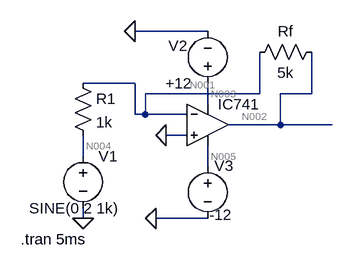
[diagram p0: schematic inverting closeloop.asc]
inverting closeloop.asc, the LTspice schematic file:
Version 4
SHEET 1 880 680
WIRE 208 32 96 32
WIRE 96 112 16 112
WIRE 288 128 288 64
WIRE 288 128 112 128
WIRE 368 128 368 64
WIRE 368 128 320 128
WIRE 208 144 208 112
WIRE 96 160 96 112
WIRE 112 160 112 128
WIRE 112 160 96 160
WIRE 176 160 112 160
WIRE 320 176 320 128
WIRE 320 176 240 176
WIRE 400 176 320 176
WIRE 176 192 144 192
WIRE 16 224 16 192
WIRE 208 240 208 208
WIRE 16 320 16 304
WIRE 208 320 128 320
FLAG 16 320 0
FLAG 128 320 0
FLAG 96 32 0
FLAG 144 192 0
SYMBOL Opamps\\UniversalOpamp2 208 176 R0
SYMATTR InstName IC741
SYMBOL voltage 16 208 R0
WINDOW 3 -83 96 Left 2
WINDOW 123 0 0 Left 0
WINDOW 39 0 0 Left 0
SYMATTR Value SINE(0 2 1k)
SYMATTR InstName V1
SYMBOL voltage 208 128 R180
WINDOW 0 31 74 Left 2
WINDOW 3 24 16 Left 2
WINDOW 123 0 0 Left 0
WINDOW 39 0 0 Left 0
SYMATTR InstName V2
SYMATTR Value +12
SYMBOL voltage 208 224 R0
WINDOW 123 0 0 Left 0
WINDOW 39 0 0 Left 0
WINDOW 0 10 15 Left 2
WINDOW 3 3 90 Left 2
SYMATTR InstName V3
SYMATTR Value -12
SYMBOL res 384 48 R90
WINDOW 0 0 56 VBottom 2
WINDOW 3 32 56 VTop 2
SYMATTR InstName Rf
SYMATTR Value 5k
SYMBOL res 0 96 R0
SYMATTR InstName R1
SYMATTR Value 1k
TEXT -80 352 Left 2 !.tran 5ms

The netlist it stands for:
* inverting closeloop.asc
XIC741 0 N001 N003 N005 N002 level.2 Avol=1Meg GBW=10Meg Slew=10Meg ilimit=25m rail=0 Vos=0 phimargin=45 en=0 enk=0 in=0 ink=0 Rin=500Meg  ; pins IN+ IN- V+ V- OUT
V1 N004 0 SINE(0 2 1k)
V2 N003 0 +12
V3 N005 0 -12
Rf N002 N001 5k
R1 N001 N004 1k
.tran 5ms
.lib UniversalOpamps2.sub
.backanno
.end

* Results of the author's LTspice run, read from the files saved beside the schematic
* Operating Point, zero values left out:
*   V(n003) = 12 V
*   V(n005) = -12 V
*   I(V3) = 1.199 mA
*   I(V2) = -1.199 mA
*   Ix(ic741:3) = 1.199 mA
*   Ix(ic741:4) = -1.199 mA
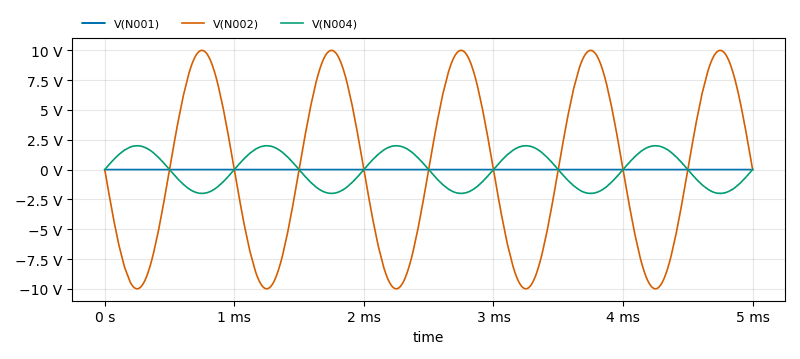
[diagram p1: Transient Analysis of inverting closeloop.asc, plotted from the saved traces]
* Transient Analysis, 1 run:
*   V(N001): min -1.003 mV, max 1.004 mV, average -8.812 nV, rms 709.6 µV, last 1.004 mV
*   V(N002): min -9.998 V, max 9.998 V, average 626.9 µV, rms 7.08 V, last 6.023 mV
*   V(N004): min -2 V, max 2 V, average -125.4 µV, rms 1.416 V, last 0 V